# Altium schematic sheet ValdisMCU.SchDoc
size A4; SPICEModelCacheOSJQPVAV: <root> / <DocumentId>OSJQPVAV</DocumentId> / <CacheFrame Number="0"> / <Model Name="led0" Kind="MDL"> / <Text>*Typ INFRARED GaAs LED: Vf=1.2V Vr=5V If=40mA trr=3uS / *LED Pinout: 1=A, 2=K / .MODEL LED0 D (IS=93.5P RS=84M N=2.63 BV=5 IBV=10U / + CJO=2.97P VJ=.75 M=.333 TT=4.32U)</Text> / </Model> / </CacheFrame> / </root>
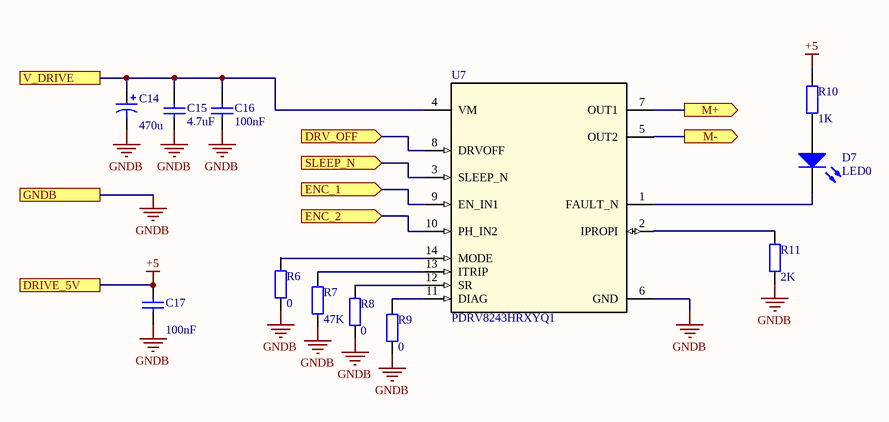
[diagram p0: ValdisMCU.SchDoc]

## Parts
C14  value 470u  [RB7.6-15]  (hidden comment: Cap Pol1)
C15  value 4.7uF  (hidden comment: Capacitor)
C16  value 100nF  (hidden comment: Capacitor)
C17  value 100nF  [RAD-0.3]  (hidden comment: Cap)
D7  LED0  [LED-0]
R6  value 0  [AXIAL-0.4]  (hidden comment: Res2)
R7  value 47K  [AXIAL-0.4]  (hidden comment: Res2)
R8  value 0  [AXIAL-0.4]  (hidden comment: Res2)
R9  value 0  [AXIAL-0.4]  (hidden comment: Res2)
R10  value 1K  [AXIAL-0.4]  (hidden comment: Res2)
R11  value 2K  [AXIAL-0.4]  (hidden comment: Res2)
U7  PDRV8243HRXYQ1  [RXY0014A-MFG]

## Ports
DRIVE_5V, DRV_OFF (in), ENC_1 (in), ENC_2 (in), GNDB, M+ (out), M- (out), SLEEP_N (in), V_DRIVE

## Nets
+5: C17.2 R10.2 ; port DRIVE_5V
GNDB: C14.2 C15.1 C16.2 C17.1 R6.1 R7.1 R8.2 R9.1 R11.1 U7.6(GND) ; port GNDB
DRV_OFF: U7.8(DRVOFF) ; port DRV_OFF
ENC_1: U7.9(EN_IN1) ; port ENC_1
ENC_2: U7.10(PH_IN2) ; port ENC_2
M+: U7.7(OUT1) ; port M+
M-: U7.5(OUT2) ; port M-
SLEEP_N: U7.3(SLEEP_N) ; port SLEEP_N
V_DRIVE: C14.1 C15.2 C16.1 U7.4(VM) ; port V_DRIVE
NetD7_1: D7.1(A) R10.1
NetD7_2: D7.2(K) U7.1(FAULT_N)
NetR6_2: R6.2 U7.14(MODE)
NetR7_2: R7.2 U7.13(ITRIP)
NetR8_1: R8.1 U7.12(SR)
NetR9_2: R9.2 U7.11(DIAG)
NetR11_2: R11.2 U7.2(IPROPI)

## Library data of the parts
C14 = Cap Pol1: Polarized Capacitor (Radial); Published: 8-Jun-2000; LatestRevisionDate: 17-Jul-2002; LatestRevisionNote: Re-released for DXP Platform.; PackageReference: RB7.6-15; Publisher: Altium Limited; PackageDescription: Polarized Capacitor (Radial); 2 Leads
C15 C16 = Capacitor: SimulationGenericComponent: True
C17 = Cap: Capacitor; Published: 8-Jun-2000; LatestRevisionDate: 17-Jul-2002; LatestRevisionNote: Re-released for DXP Platform.; PackageReference: RAD-0.3; Publisher: Altium Limited; PackageDescription: Radial Cap, Thru-Hole; 2 Leads; 0.3 in Pin Spacing
D7 = LED0: Typical INFRARED GaAs LED; Published: 8-Jun-2000; LatestRevisionDate: 08-Jul-2005; LatestRevisionNote: Mech Layer 1 removed.; PackageReference: LED-0; Publisher: Altium Limited; PackageDescription: LED; 2 Leads
R6-R11 = Res2: Resistor; Published: 8-Jun-2000; LatestRevisionDate: 17-Jul-2002; LatestRevisionNote: Re-released for DXP Platform.; PackageReference: AXIAL-0.4; Publisher: Altium Limited; PackageDescription: Axial Device, Thru-Hole; 2 Leads; 0.4 in Pin Spacing
U7 = PDRV8243HRXYQ1: No Description Available; Mfr_Name: Texas Instruments; Type: DEV; RefDes: RefDes; Copyright: Copyright (C) 2022 Ultra Librarian. All rights reserved.; Manufacturer_Part_Number: PDRV8243HRXYQ1